# EasyEDA Pro project myProject.eprj

# Schematic Schematic1
Create Date: 2023-12-27; Page Name: P1; Project Name: myProject; Schematic Name: Schematic1; Update Date: 2023-12-27; Company: EasyEDA.com; Drawed: EasyEDA Pro; Page Size: A4; Part Number: JLCPCB-002; Reviewed: EasyEDA Pro; Version: V0.1
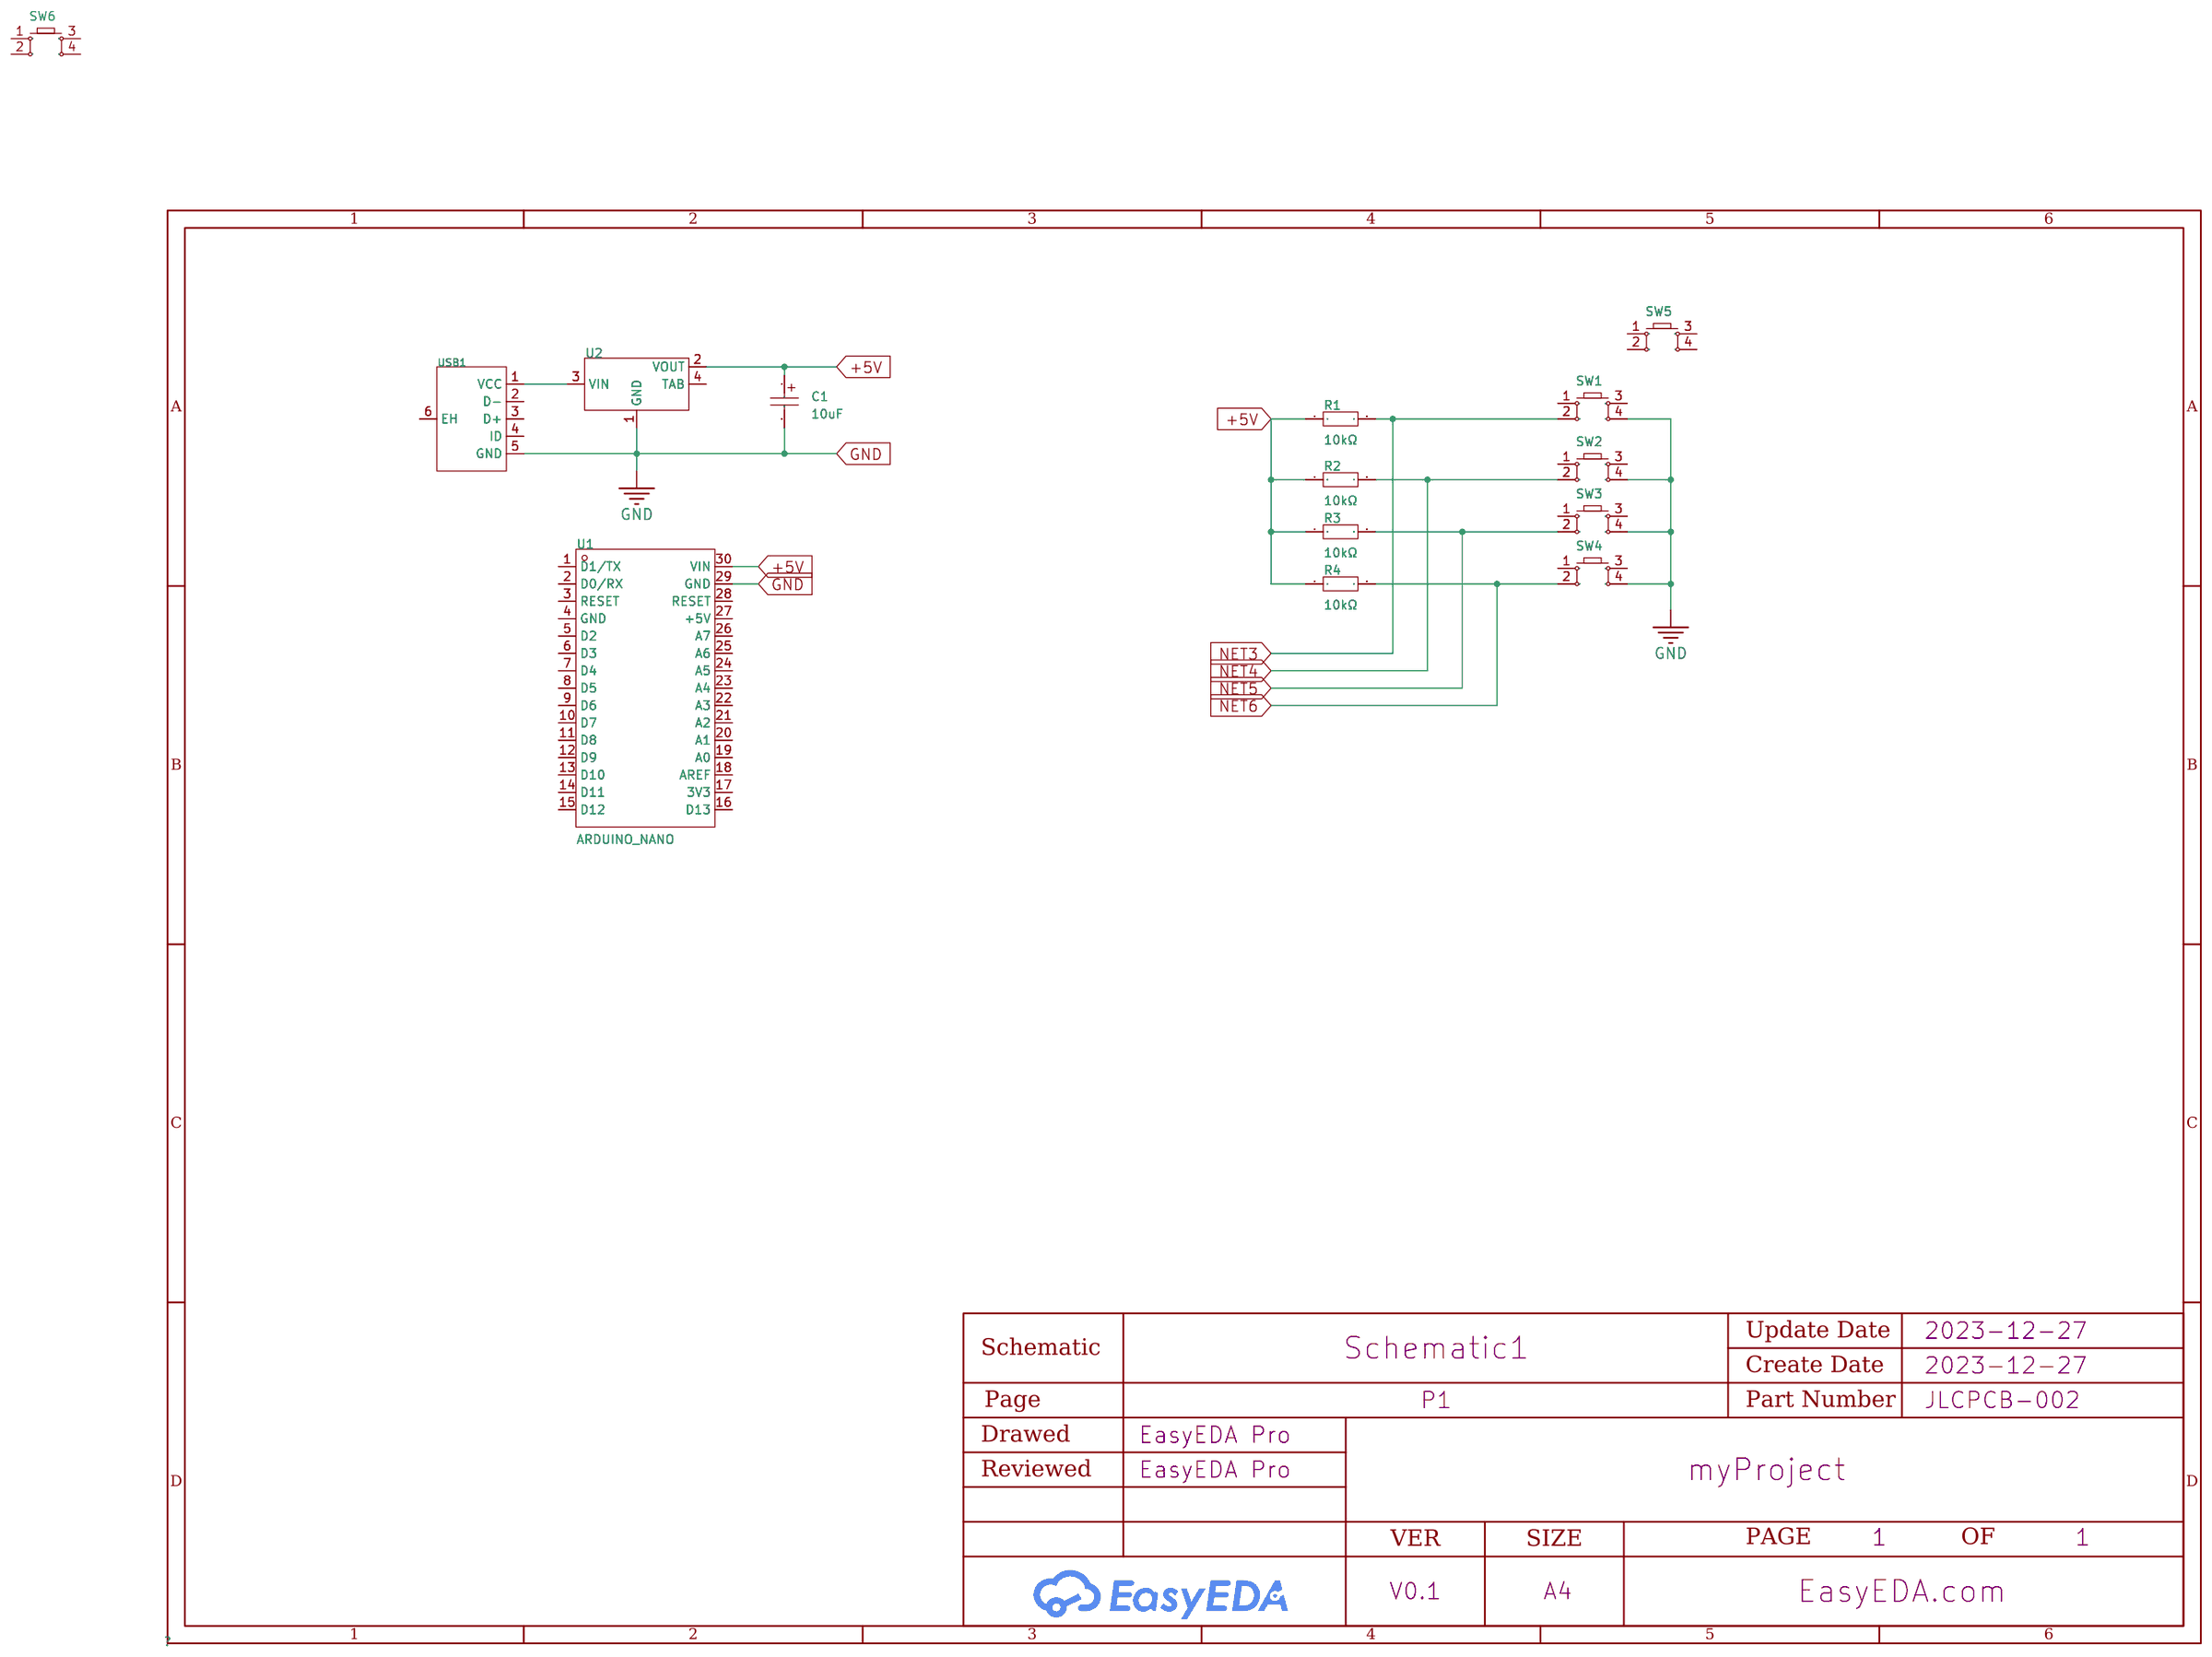
[diagram p0: schematic sheet]

## Parts
C1  10uF  [CAP-SMD_BD3.0-L3.3-W3.3-RD]
R1  10kΩ  [R_AXIAL-0.4]
R2  10kΩ  [R_AXIAL-0.4]
R3  10kΩ  [R_AXIAL-0.4]
R4  10kΩ  [R_AXIAL-0.4]
SW1  -  [SW-TH_4P-L6.0-W6.0-P4.50-LS6.5]
SW2  -  [SW-TH_4P-L6.0-W6.0-P4.50-LS6.5]
SW3  -  [SW-TH_4P-L6.0-W6.0-P4.50-LS6.5]
SW4  -  [SW-TH_4P-L6.0-W6.0-P4.50-LS6.5]
SW5  -  [SW-TH_4P-L6.0-W6.0-P4.50-LS6.5]
SW6  -  [SW-TH_4P-L6.0-W6.0-P4.50-LS6.5]
U1  ARDUINO_NANO  [COMM-TH_ARDUINO_NANO]
U2  -  [SOT-223_L6.7-W3.5-P2.30-BR]
USB1  -  [MINI-USB-SMD_MICRO-4P-DIP]

## Library data of the parts
C1 = C_Ele_SMD_3x5.4mm: Supplier Footprint: SMD,3x5.4mm
R1-R4 = Res_AXIAL-1/4W: Supplier Footprint: Through
SW1-SW6 = Key_TH_6x6x5.5: Supplier Footprint: Through
U1 = ARDUINO_NANO: Supplier Part: C9900017879; Supplier Footprint: 插件; Datasheet: https://atta.szlcsc.comnull; Supplier: LCSC
U2 = AMS1117-5.0V: Supplier Footprint: SOT-223
USB1 = USB_Micro-B: Supplier Footprint: SMD

## Nets
+5V: C1.1 R1.1 R2.1 R3.1 R4.1 U1.30(VIN) U2.2(VOUT)
GND: C1.2 SW1.4 SW2.4 SW3.4 SW4.4 U1.29(GND) U2.1(GND) USB1.5(GND)
NET3: R1.2 SW1.2
NET4: R2.2 SW2.2
NET5: R3.2 SW3.2
NET6: R4.2 SW4.2
$1N535: U2.3(VIN) USB1.1(VCC)

Not connected (* = marked no-connect by the designer): SW1 1 3; SW2 1 3; SW3 1 3; SW4 1 3; SW5 1 2 3 4; SW6 1 2 3 4; U1 1(D1/TX) 2(D0/RX) 3(RESET) 4(GND) 5(D2) 6(D3) 7(D4) 8(D5) 9(D6) 10(D7) 11(D8) 12(D9) 13(D10) 14(D11) 15(D12) 16(D13) 17(3V3) 18(AREF) 19(A0) 20(A1) 21(A2) 22(A3) 23(A4) 24(A5) 25(A6) 26(A7) 27(+5V) 28(RESET); U2 4(TAB); USB1 2(D-) 3(D+) 4(ID) 6(EH)

# Board PCB1
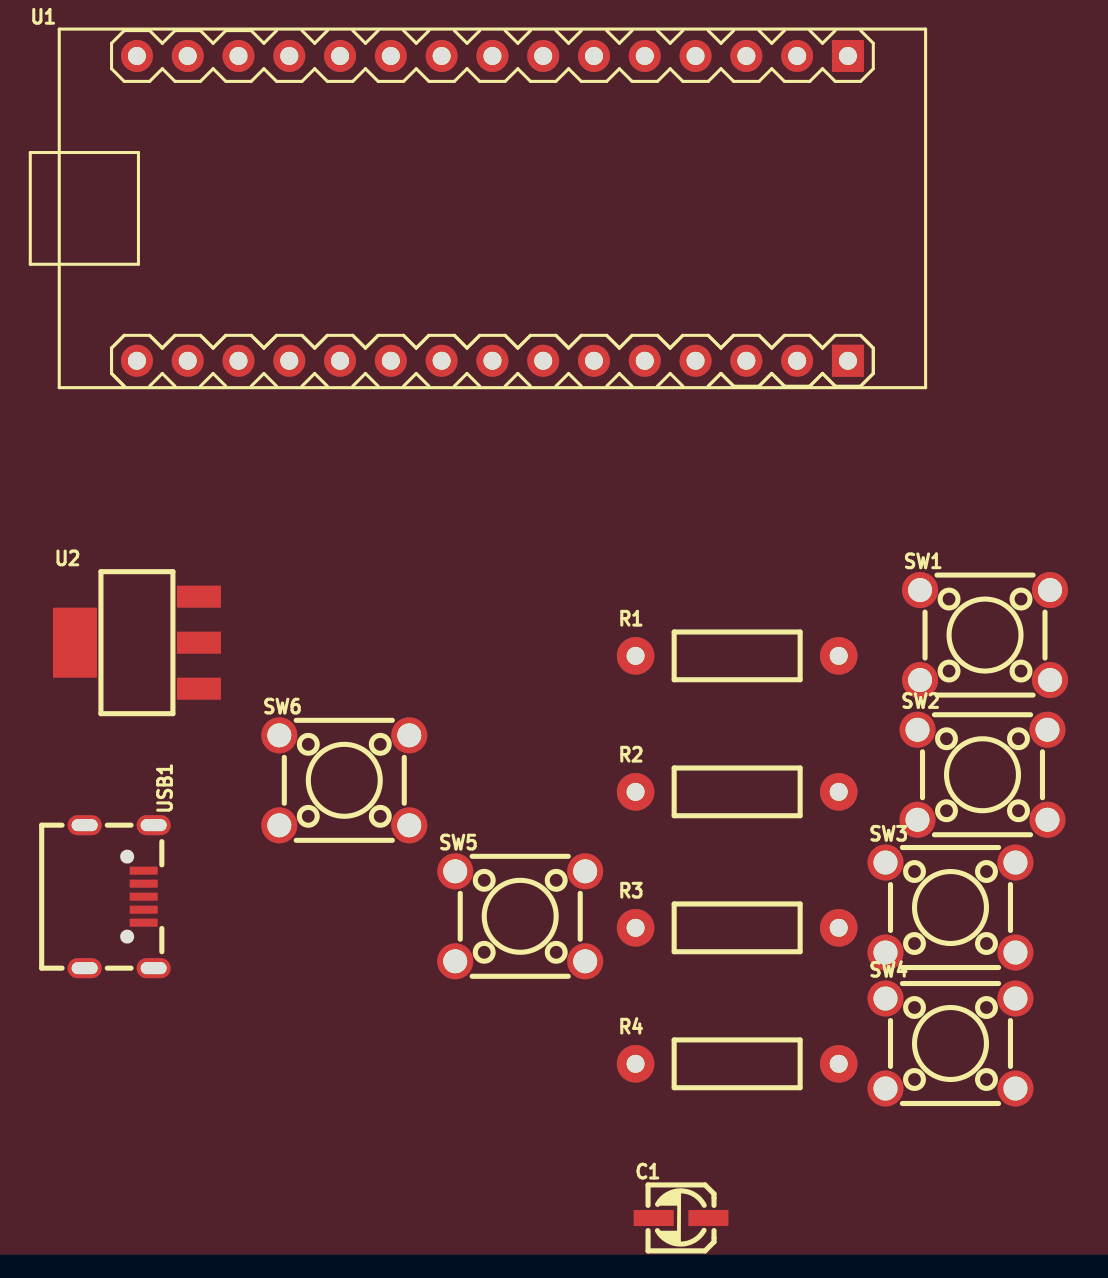
[diagram p1: board, top side]
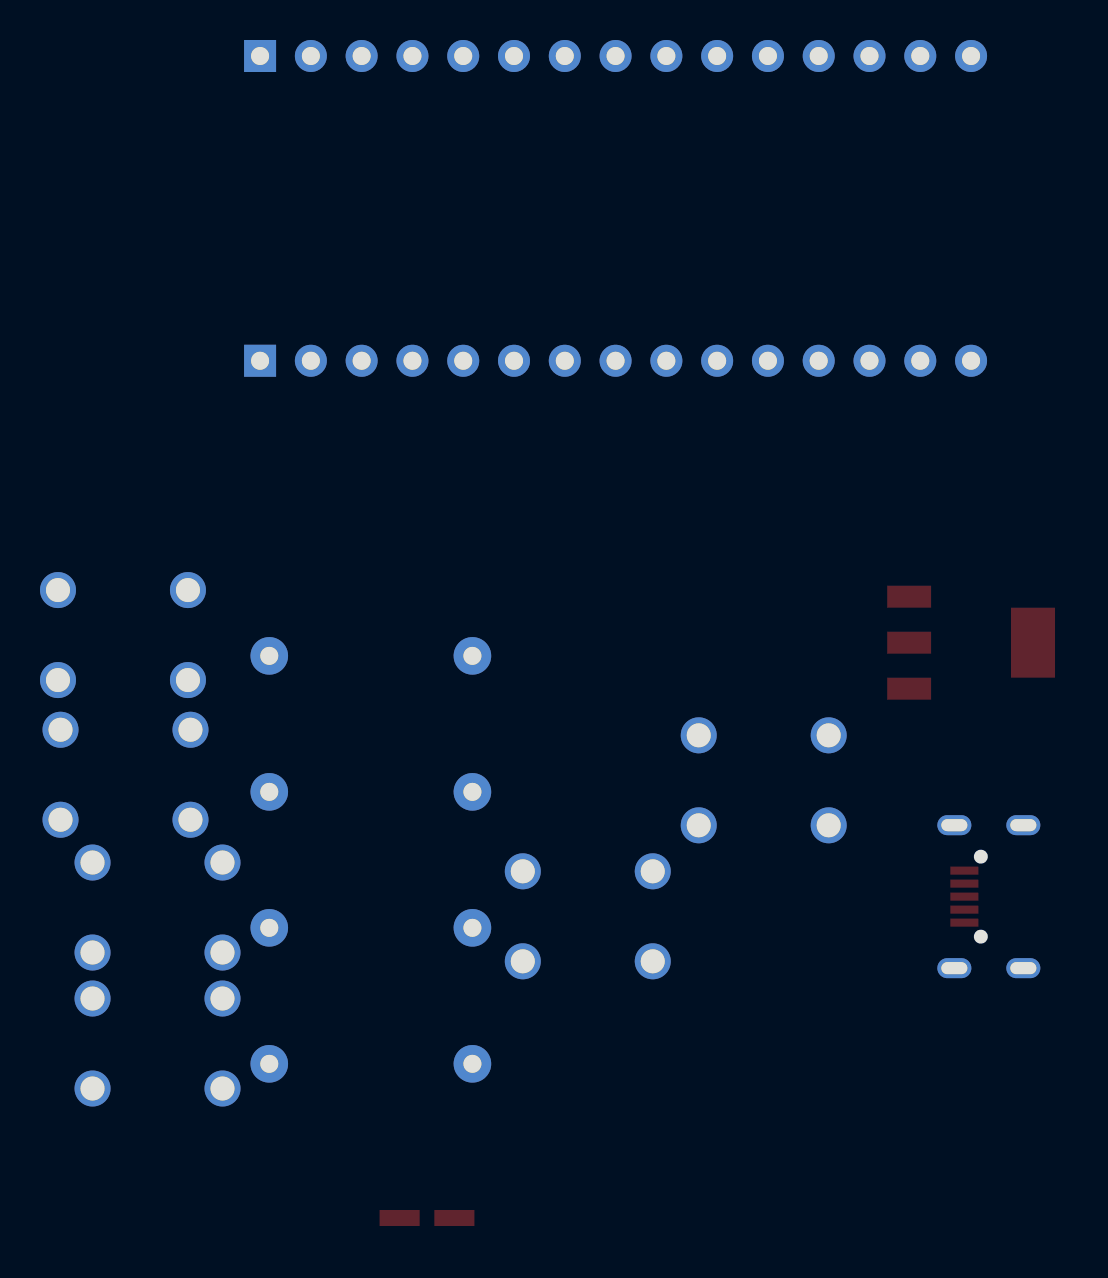
[diagram p2: board, bottom side, seen from below]

Outline 0.69 x 4.69 mm; copper layers: Top Layer, Bottom Layer. Coordinates in mm from the lower left corner of the outline.
Stack: Top Layer 0.035mm / Dielectric1 1.51mm FR4 er 4.5 / Bottom Layer 0.035mm

## Design rules (mm)
template: JLCPCB Capability(Two Layers Board)
spacing copperThickness1oz (default): track to track 0.102, other pairs 0.152 to 0.3
spacing copperThickness2oz: track to track 0.203, other pairs 0.152 to 0.3
track width copperThickness1oz (default): min 0.127, default 0.254, max 2.54
track width copperThickness2oz: min 0.203, default 0.254, max 2.54
differential pair differentialPair (default): width min 0.127, default 0.254, max 2.54; gap min 0.152, default 0.152
via viaSize (default): diameter min 0.5, default 0.61, max 10; hole min 0.3, default 0.305, max 6.3

## Placement (name value [footprint] x y rotation side)
C1  10uF  [CAP-SMD_BD3.0-L3.3-W3.3-RD]  28.05 -13.72 0 top
R1  10kΩ  [R_AXIAL-0.4]  30.86 14.39 0 top
R2  10kΩ  [R_AXIAL-0.4]  30.86 7.59 0 top
R3  10kΩ  [R_AXIAL-0.4]  30.86 0.79 0 top
R4  10kΩ  [R_AXIAL-0.4]  30.86 -6.01 0 top
SW1  -  [SW-TH_4P-L6.0-W6.0-P4.50-LS6.5]  43.25 15.43 0 top
SW2  -  [SW-TH_4P-L6.0-W6.0-P4.50-LS6.5]  43.13 8.44 0 top
SW3  -  [SW-TH_4P-L6.0-W6.0-P4.50-LS6.5]  41.53 1.8 0 top
SW4  -  [SW-TH_4P-L6.0-W6.0-P4.50-LS6.5]  41.53 -5 0 top
SW5  -  [SW-TH_4P-L6.0-W6.0-P4.50-LS6.5]  20.01 1.36 0 top
SW6  -  [SW-TH_4P-L6.0-W6.0-P4.50-LS6.5]  11.21 8.16 0 top
U1  ARDUINO_NANO  [COMM-TH_ARDUINO_NANO]  18.62 36.76 0 top
U2  -  [SOT-223_L6.7-W3.5-P2.30-BR]  0.84 15.05 0 top
USB1  -  [MINI-USB-SMD_MICRO-4P-DIP]  -0.05 2.35 270 top

## Footprints (pads in the part's own frame, mm; a bottom-side part is the same pattern mirrored in y, then rotated)
CAP-SMD_BD3.0-L3.3-W3.3-RD
  rect 2x0.8 smd: 1(1.37,0) 2(-1.37,0)
COMM-TH_ARDUINO_NANO
  rect 1.6x1.6 hole 0.9: 1(17.78,7.62) 30(17.78,-7.62)
  round 1.6 hole 0.9: 2(15.24,7.62) 3(12.7,7.62) 4(10.16,7.62) 5(7.62,7.62) 6(5.08,7.62) 7(2.54,7.62) 8(0,7.62) 9(-2.54,7.62) 10(-5.08,7.62) 11(-7.62,7.62) 12(-10.16,7.62) 13(-12.7,7.62) 14(-15.24,7.62) 15(-17.78,7.62) 16(-17.78,-7.62) 17(-15.24,-7.62) 18(-12.7,-7.62) 19(-10.16,-7.62) 20(-7.62,-7.62) 21(-5.08,-7.62) 22(-2.54,-7.62) 23(0,-7.62) 24(2.54,-7.62) 25(5.08,-7.62) 26(7.62,-7.62) 27(10.16,-7.62) 28(12.7,-7.62) 29(15.24,-7.62)
MINI-USB-SMD_MICRO-4P-DIP
  rect 0.4x1.4 smd: 1(-1.3,1.225) 2(-0.65,1.225) 3(0,1.225) 4(0.65,1.225) 5(1.3,1.225)
  oval 1x1.7 hole 0.6x1.3: 6(-3.575,1.725) 6(-3.575,-1.725) 6(3.575,1.725) 6(3.575,-1.725)
R_AXIAL-0.4
  round 1.879 hole 0.899: 1(-5.08,0) 2(5.08,0)
SOT-223_L6.7-W3.5-P2.30-BR
  rect 2.2x1.1 smd: 1(3.099,-2.3) 2(3.099,0) 3(3.099,2.3)
  rect 2.2x3.5 smd: 4(-3.099,0)
SW-TH_4P-L6.0-W6.0-P4.50-LS6.5
  round 1.8 hole 1.2: 1(-3.25,2.25) 2(3.25,2.25) 3(-3.25,-2.25) 4(3.25,-2.25)

## Nets
As in the schematic.

Pads without a net: SW1 1 3; SW2 1 3; SW3 1 3; SW4 1 3; SW5 1 2 3 4; SW6 1 2 3 4; U1 1 2 3 4 5 6 7 8 9 10 11 12 13 14 15 16 17 18 19 20 21 22 23 24 25 26 27 28; U2 4; USB1 2 3 4 6

## Copper pours and planes (outline as drawn; the poured copper is in the pictures)
GND on Top Layer: -13.26,52.64 54.18,52.64 54.18,-15.56 -13.26,-15.56
